# EAGLE design bb-expansion (EAGLE 5.06)
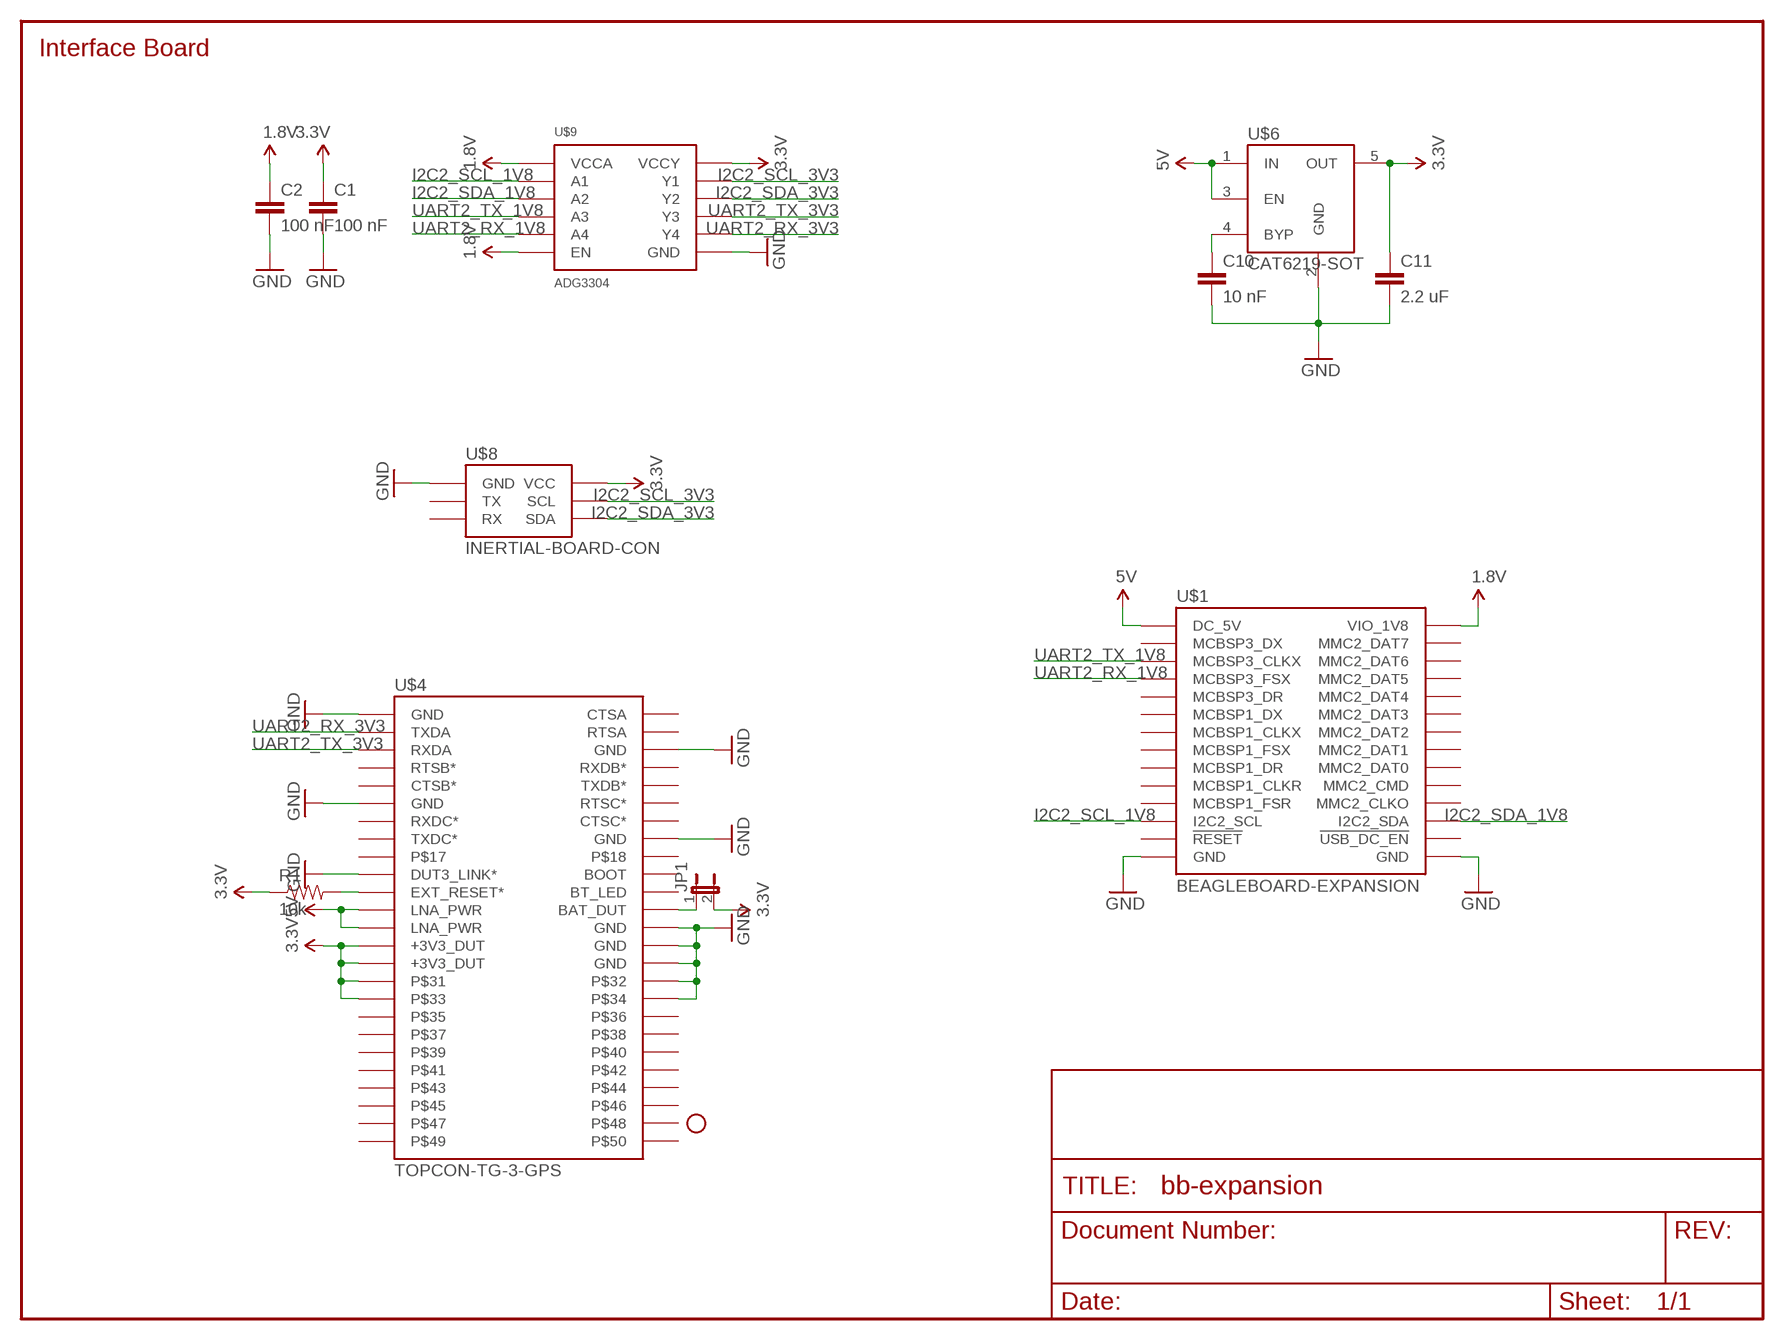
[diagram p0: schematic, sheet 1]

## Parts
C1  100 nF  CAP-0805  [0805]
C2  100 nF  CAP-0805  [0805]
C10  10 nF  CAP-0805  [0805]
C11  2.2 uF  CAP-0805  [0805]
JP1  JUMPER-2SMD-NO  [SJ_2S-NO]
JP2  STAND-OFF  [STAND-OFF]
R1  10k  RESISTOR  [0805]
U$1  BEAGLEBOARD-EXPANSION  [BEAGLEBOARD-EXPANSION]
U$4  TOPCON-TG-3-GPS  [FCI-62684-FFC-CON]
U$6  CAT6219-SOT  [SOT23-5]
U$8  INERTIAL-BOARD-CON  [2X03]
U$9  ADG3304  [TSSOP14]

## Nets
1.8V: C2.1 U$1.P$1(VIO_1V8) U$9.1(VCCA) U$9.8(EN)
3.3V: C1.1 C11.1 JP1.2 R1.1 U$4.P$27(+3V3_DUT) U$4.P$29(+3V3_DUT) U$4.P$31 U$4.P$33 U$6.5(OUT) U$8.P$2(VCC) U$9.14(VCCY)
5V: U$1.P$2(DC_5V) U$4.P$23(LNA_PWR) U$4.P$25(LNA_PWR) U$6.1(IN) U$6.3(EN)
GND: C1.2 C2.2 C10.2 C11.2 U$1.P$27(GND) U$1.P$28(GND) U$4.P$1(GND) U$4.P$6(GND) U$4.P$11(GND) U$4.P$16(GND) U$4.P$19(DUT3_LINK*) U$4.P$26(GND) U$4.P$28(GND) U$4.P$30(GND) U$4.P$32 U$4.P$34 U$6.2(GND) U$8.P$1(GND) U$9.7(GND)
I2C2_SCL_1V8: U$1.P$24(I2C2_SCL) U$9.2(A1)
I2C2_SCL_3V3: U$8.P$4(SCL) U$9.13(Y1)
I2C2_SDA_1V8: U$1.P$23(I2C2_SDA) U$9.3(A2)
I2C2_SDA_3V3: U$8.P$6(SDA) U$9.12(Y2)
N$1: R1.2 U$4.P$21(EXT_RESET*)
N$2: JP1.1 U$4.P$24(BAT_DUT)
N$19: C10.1 U$6.4(BYP)
UART2_RX_1V8: U$1.P$8(MCBSP3_FSX) U$9.5(A4)
UART2_RX_3V3: U$4.P$3(TXDA) U$9.10(Y4)
UART2_TX_1V8: U$1.P$6(MCBSP3_CLKX) U$9.4(A3)
UART2_TX_3V3: U$4.P$5(RXDA) U$9.11(Y3)
Unconnected: U$1.P$3(MMC2_DAT7) U$1.P$4(MCBSP3_DX) U$1.P$5(MMC2_DAT6) U$1.P$7(MMC2_DAT5) U$1.P$9(MMC2_DAT4) U$1.P$10(MCBSP3_DR) U$1.P$11(MMC2_DAT3) U$1.P$12(MCBSP1_DX) U$1.P$13(MMC2_DAT2) U$1.P$14(MCBSP1_CLKX) U$1.P$15(MMC2_DAT1) U$1.P$16(MCBSP1_FSX) U$1.P$17(MMC2_DAT0) U$1.P$18(MCBSP1_DR) U$1.P$19(MMC2_CMD) U$1.P$20(MCBSP1_CLKR) U$1.P$21(MMC2_CLKO) U$1.P$22(MCBSP1_FSR) U$1.P$25(!USB_DC_EN!) U$1.P$26(!RESET!) U$4.P$2(CTSA) U$4.P$4(RTSA) U$4.P$7(RTSB*) U$4.P$8(RXDB*) U$4.P$9(CTSB*) U$4.P$10(TXDB*) U$4.P$12(RTSC*) U$4.P$13(RXDC*) U$4.P$14(CTSC*) U$4.P$15(TXDC*) U$4.P$17 U$4.P$18 U$4.P$20(BOOT) U$4.P$22(BT_LED) U$4.P$35 U$4.P$36 U$4.P$37 U$4.P$38 U$4.P$39 U$4.P$40 U$4.P$41 U$4.P$42 U$4.P$43 U$4.P$44 U$4.P$45 U$4.P$46 U$4.P$47 U$4.P$48 U$4.P$49 U$4.P$50 U$8.P$3(TX) U$8.P$5(RX)

## Notes on the sheet
- Interface Board

## Library data of the parts
C1 C2 C10 C11 = michael:CAP: Capacitor Standard 0603 ceramic capacitor, and 0.1" leaded capacitor.
JP1 = SparkFun:JUMPER-2: Jumper Basic 0.1" spaced jumper. Use with breakaway headers.
JP2 = SparkFun:STAND-OFF: Stand Off This is the mechanical footprint for a #4 phillips button head screw. Use the keepout ring to avoid running the screw head into surrounding components. SKU : PRT-00447
R1 = SparkFun:RESISTOR: Resistor Basic schematic elements and footprints for 0603, 1206, and PTH 1/10th watt (small) resistors.
U$1 = michael:BEAGLEBOARD-EXPANSION
U$4 = michael:TOPCON-TG-3-GPS
U$6 = michael:CAT6219
U$8 = michael:INERTIAL-BOARD-CON
U$9 = michael:ADG3304

## Board
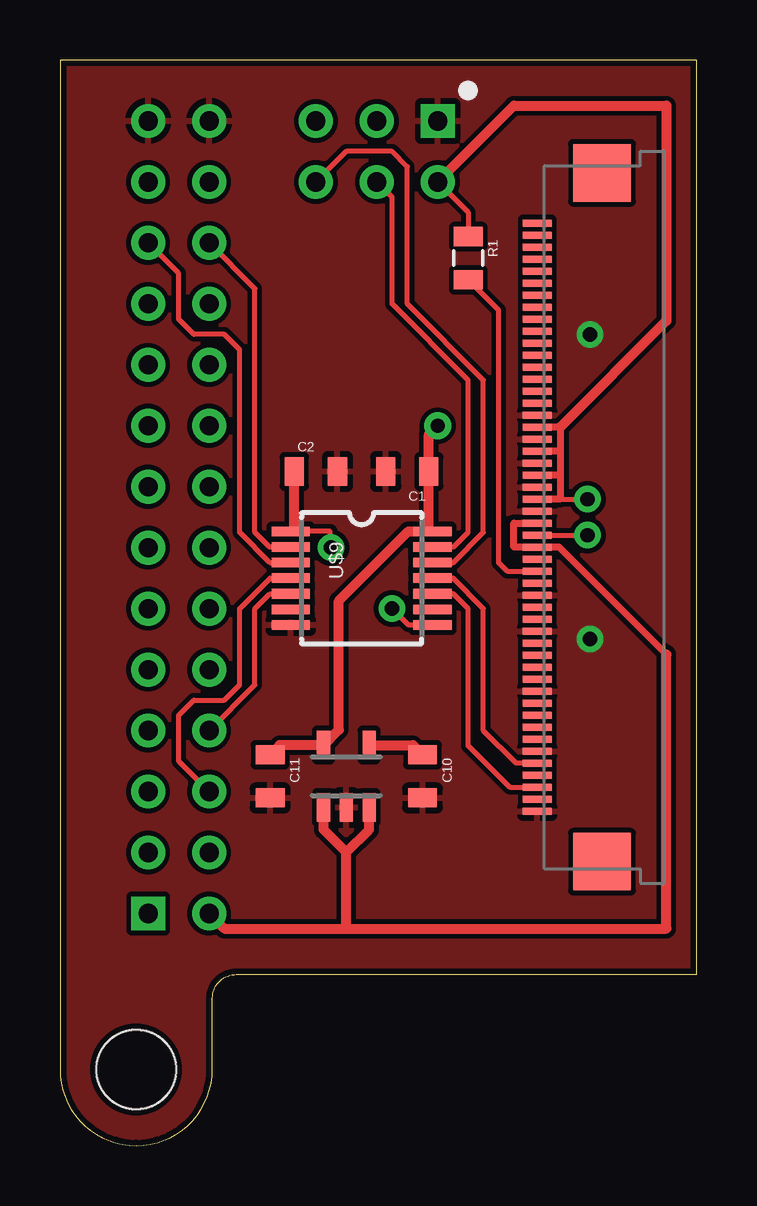
[diagram p1: board, top side]
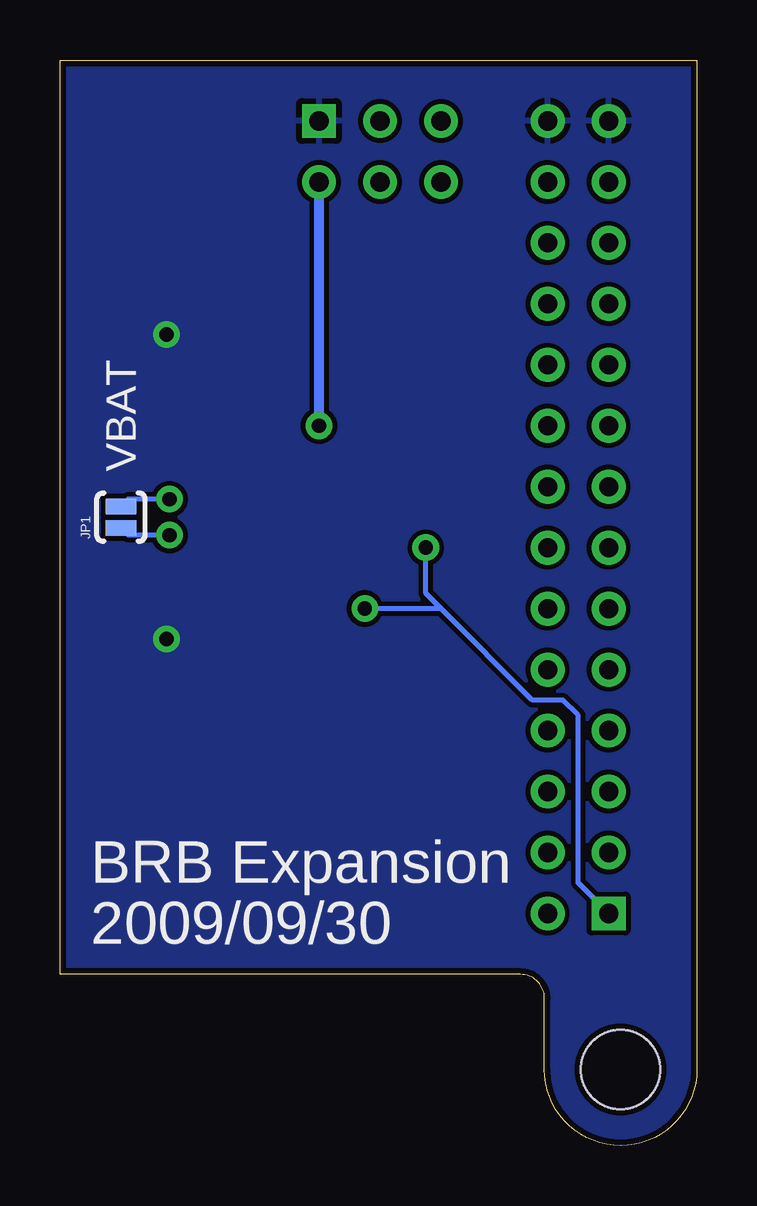
[diagram p2: board, bottom side, seen from below]

Size 26.54 x 45.23 mm. Coordinates in mm from the lower left corner, seen from the top.
Outline: 26.54,7.13 26.54,45.23 0,45.23 0,3.17 arc90 3.17,0 arc90 6.35,3.17 6.35,6.13 arc-90 7.35,7.13 26.54,7.13
Copper layers (1*16): Top 0.035mm / dielectric 1.5mm / Bottom 0.035mm
Design rules "SparkFun": minimum track width 8mil, minimum drill 20mil, track to track 8mil, track to pad 8mil, pad to pad 8mil, via to via 8mil, smd to smd 8mil, copper to edge 10mil, drill to drill 8mil, minimum pad ring 12mil, minimum via ring 10mil, stop-mask expansion 4mil, vias tented up to drill 25mil, thermal gap 10mil

### Footprints (pad centres in the part's own frame; a part is rotated, then mirrored left to right if it is on the bottom)
0805 = smd 0.8 x 1.2: 1 -0.9,0; 2 0.9,0
SJ_2S-NO = smd 0.635 x 1.27: 1 -0.45,0; 2 0.45,0
STAND-OFF = hole 3.302: 0,0
BEAGLEBOARD-EXPANSION = drill 0.8 square: P$1 0,0 | drill 0.8 round: P$2 2.54,0; P$3 0,2.54; P$4 2.54,2.54; P$5 0,5.08; P$6 2.54,5.08; P$7 0,7.62; P$8 2.54,7.62; P$9 0,10.16; P$10 2.54,10.16; P$11 0,12.7; P$12 2.54,12.7; P$13 0,15.24; P$14 2.54,15.24; P$15 0,17.78; P$16 2.54,17.78; P$17 0,20.32; P$18 2.54,20.32; P$19 0,22.86; P$20 2.54,22.86; P$21 0,25.4; P$22 2.54,25.4; P$23 0,27.94; P$24 2.54,27.94; P$25 0,30.48; P$26 2.54,30.48; P$27 0,33.02; P$28 2.54,33.02
FCI-62684-FFC-CON = smd 0.297 x 1.2: P$1 -12.25,0.3; P$2 -11.75,0.3; P$3 -11.25,0.3; P$4 -10.75,0.3; P$5 -10.25,0.3; P$6 -9.75,0.3; P$7 -9.25,0.3; P$8 -8.75,0.3; P$9 -8.25,0.3; P$10 -7.75,0.3; P$11 -7.25,0.3; P$12 -6.75,0.3; P$13 -6.25,0.3; P$14 -5.75,0.3; P$15 -5.25,0.3; P$16 -4.75,0.3; P$17 -4.25,0.3; P$18 -3.75,0.3; P$19 -3.25,0.3; P$20 -2.75,0.3; P$21 -2.25,0.3; P$22 -1.75,0.3; P$23 -1.25,0.3; P$24 -0.75,0.3; P$25 -0.25,0.3; P$26 0.25,0.3; P$27 0.75,0.3; P$28 1.25,0.3; P$29 1.75,0.3; P$30 2.25,0.3; P$31 2.75,0.3; P$32 3.25,0.3; P$33 3.75,0.3; P$34 4.25,0.3; P$35 4.75,0.3; P$36 5.25,0.3; P$37 5.75,0.3; P$38 6.25,0.3; P$39 6.75,0.3; P$40 7.25,0.3; P$41 7.75,0.3; P$42 8.25,0.3; P$43 8.75,0.3; P$44 9.25,0.3; P$45 9.75,0.3; P$46 10.25,0.3; P$47 10.75,0.3; P$48 11.25,0.3; P$49 11.75,0.3; P$50 12.25,0.3 | smd 2.4 x 2.4: P$51 -14.35,-2.4; P$52 14.35,-2.4
SOT23-5 = smd 0.55 x 1.2: 1 -0.95,-1.3; 2 0,-1.3; 3 0.95,-1.3; 4 0.95,1.3; 5 -0.95,1.3
2X03 = drill 0.8 square: P$1 5.08,2.54 | drill 0.8 round: P$2 5.08,0; P$3 2.54,2.54; P$4 2.54,0; P$5 0,2.54; P$6 0,0
TSSOP14 = smd 0.4 x 1.6: 1 -1.95,-2.95; 2 -1.3,-2.95; 3 -0.65,-2.95; 4 0,-2.95; 5 0.65,-2.95; 6 1.3,-2.95; 7 1.95,-2.95; 8 1.95,2.95; 9 1.3,2.95; 10 0.65,2.95; 11 0,2.95; 12 -0.65,2.95; 13 -1.3,2.95; 14 -1.95,2.95

### Placement (x,y rotation side)
C1  14.47,28.09 180 top
C2  10.66,28.09 0 top
C10  15.11,15.39 270 top
C11  8.76,15.39 270 top
JP1  24,26.19 90 bottom
JP2  3.17,3.17 0 top
R1  17.01,36.98 270 top
U$1  3.67,9.68 0 top
U$4  20.19,26.19 90 top
U$6  11.93,15.39 0 top
U$8  10.66,40.16 0 top
U$9  12.56,23.65 270 top

### Tracks (layer width: path | path; a pad name or v marks a point on that pad's centre or on a via)
1.8V  (via drill 0.6)
  Top 0.203: 9.76,25.59 11.25,25.59 v11.29,24.91 | U$9.8 14.52,21.7 v13.83,22.38
  Top 0.406: C2.1 9.76,25.59 U$9.1
  Bottom 0.203: U$1.P$1 4.95,10.95 4.95,17.93 5.58,18.56 6.85,18.56 10.66,22.38 | v11.29,24.91 11.29,23.01 10.66,22.38 | 10.66,22.38 v13.83,22.38
3.3V  (via drill 0.6)
  Top 0.203: R1.1 17.01,38.88 U$8.P$2 | 20.84,26.94 v21.98,26.94
  Top 0.297: 20.84,27.94 20.84,26.94 U$4.P$27 | 20.84,27.94 U$4.P$29 | 20.84,28.94 U$4.P$31 | 20.84,28.94 20.84,27.94 | U$4.P$33 20.84,29.94 20.84,28.94
  Top 0.406: C11.1 9.15,16.69 U$6.5 11.62,17.32 11.62,22.7 14.52,25.59 15.37,25.59 | 15.37,25.59 C1.1 15.37,29.62 v15.74,29.99 | 15.37,25.59 U$9.14 | U$8.P$2 18.92,43.33 25.27,43.33 25.27,34.36 20.84,29.94
  Bottom 0.203: v21.98,26.94 23.7,26.94 JP1.2
  Bottom 0.406: v15.74,29.99 U$8.P$2
5V
  Top 0.297: U$4.P$25 18.92,25.94 18.92,24.94 U$4.P$23 20.8,24.94 25.27,20.47
  Top 0.406: U$1.P$2 6.85,9.04 11.93,9.04 | 11.93,9.04 25.27,9.04 25.27,20.47 | U$6.1 10.98,13.16 11.93,12.21 | 11.93,9.04 11.93,12.21 | U$6.3 12.88,13.16 11.93,12.21
GND  (via drill 0.6)
  other vias: 22.09,21.11 22.09,33.8
  pour Bottom: 26.54,0 26.54,45.23 0,45.23 0,3.17 arc90 3.17,0
  pour Top: 26.54,0 26.54,45.23 0,45.23 0,3.17 arc90 3.17,0
I2C2_SCL_1V8
  Top 0.203: U$1.P$24 8.12,35.71 8.12,25.55 8.72,24.95 U$9.2
I2C2_SCL_3V3
  Top 0.203: U$9.13 16.41,24.95 17.01,25.55 17.01,31.9 13.83,35.08 13.83,39.52 U$8.P$4
I2C2_SDA_1V8
  Top 0.203: U$1.P$23 4.95,36.34 4.95,34.44 5.58,33.8 6.85,33.8 7.48,33.17 7.48,25.55 8.74,24.3 U$9.3
I2C2_SDA_3V3
  Top 0.203: U$9.12 16.39,24.3 17.65,25.55 17.65,31.9 14.47,35.08 14.47,40.79 13.83,41.42 11.93,41.42 U$8.P$6
N$1
  Top 0.203: R1.2 18.28,34.81 18.28,24.28 18.62,23.94 U$4.P$21
N$2  (via drill 0.6)
  Top 0.203: U$4.P$24 v21.98,25.44
  Bottom 0.203: v21.98,25.44 23.7,25.44 JP1.1
N$19
  Top 0.406: C10.1 14.71,16.69 U$6.4
UART2_RX_1V8
  Top 0.203: U$1.P$8 8.12,19.2 8.12,22.38 8.74,22.99 U$9.5
UART2_RX_3V3
  Top 0.203: U$9.10 16.39,22.99 17.01,22.38 17.01,16.66 18.74,14.93 U$4.P$3
UART2_TX_1V8
  Top 0.203: U$1.P$6 4.95,16.02 4.95,17.93 5.58,18.56 6.85,18.56 7.48,19.2 7.48,22.38 8.76,23.65 U$9.4
UART2_TX_3V3
  Top 0.203: U$9.11 16.38,23.65 17.65,22.38 17.65,17.3 19.01,15.94 U$4.P$5

### Text on the board
bPlace: VBAT | BRB Expansion | 2009/09/30